# Altium schematic sheet SDCard.SchDoc
size A
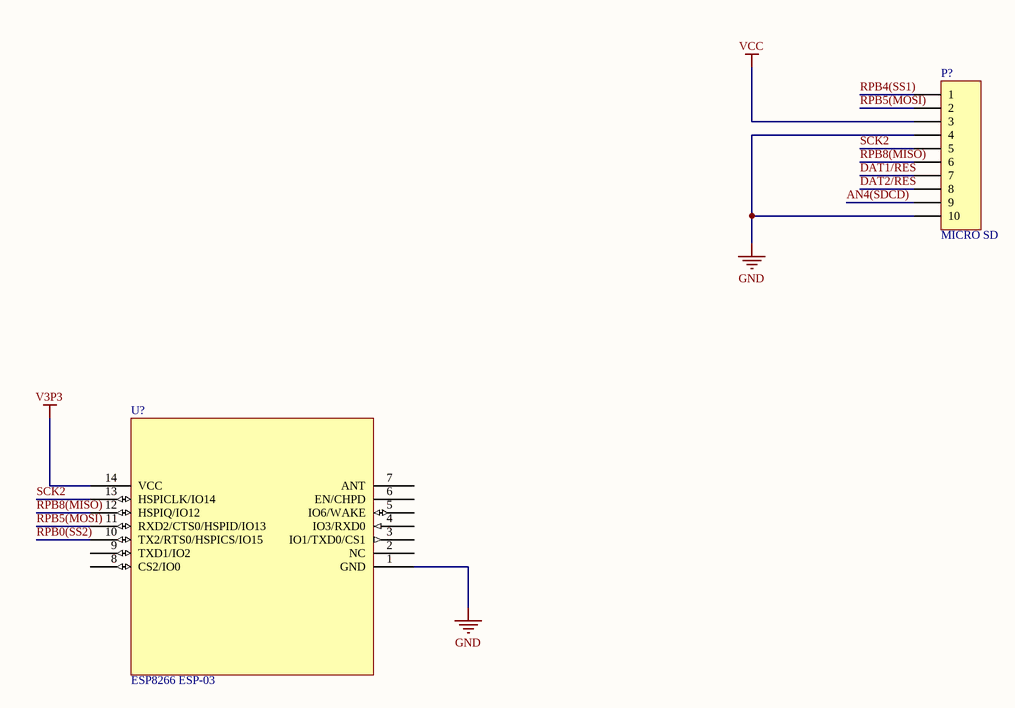
[diagram p0: SDCard.SchDoc]

## Parts
P?  MICRO SD  [HDR1X10]
U?  ESP8266 ESP-03

## Nets
GND: P?.4 P?.10 U?.1(GND)
V3P3: U?.14(VCC)
VCC: P?.3
AN4(SDCD): P?.9
DAT1/RES: P?.7
DAT2/RES: P?.8
RPB0(SS2): U?.10(TX2/RTS0/HSPICS/IO15)
RPB4(SS1): P?.1
RPB5(MOSI): P?.2 U?.11(RXD2/CTS0/HSPID/IO13)
RPB8(MISO): P?.6 U?.12(HSPIQ/IO12)
SCK2: P?.5 U?.13(HSPICLK/IO14)

Not connected (* = marked no-connect by the designer): U? 2(NC) 3(IO1/TXD0/CS1) 4(IO3/RXD0) 5(IO6/WAKE) 6(EN/CHPD) 7(ANT) 8(CS2/IO0) 9(TXD1/IO2)

## Library data of the parts
P? = Header 10: Header, 10-Pin; LatestRevisionDate: 17-Jul-2002; LatestRevisionNote: Re-released for DXP Platform.; Publisher: Altium Limited